# Altium schematic sheet 1x9x1.SchDoc
size A; SheetNumber: 1; SheetTotal: 3
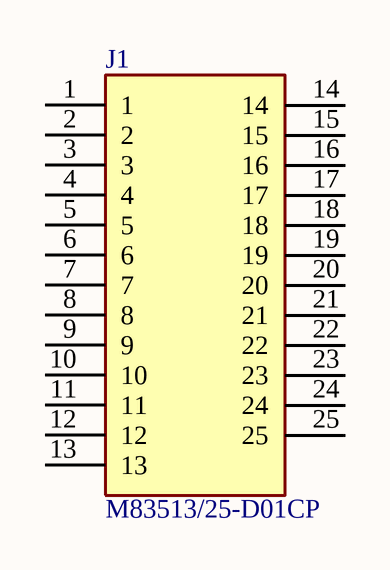
[diagram p0: 1x9x1.SchDoc]

## Parts
J1  M83513/25-D01CP  [BEL_M83513/25-D01CP]

## Nets

Not connected (* = marked no-connect by the designer): J1 1 2 3 4 5 6 7 8 9 10 11 12 13 14 15 16 17 18 19 20 21 22 23 24 25

## Library data of the parts
J1 = M83513/25-D01CP: MIL-DTL-83513 PCB Mounted Connector | Socket | 25 Positions | Shell Finish - Cadmium | Female | PCB Solder Pins | 0.109" (2.77 mm) Pin Length; Package: None; Price: None; Value: *; MP: M83513/25-D01CP; Availability: Unavailable